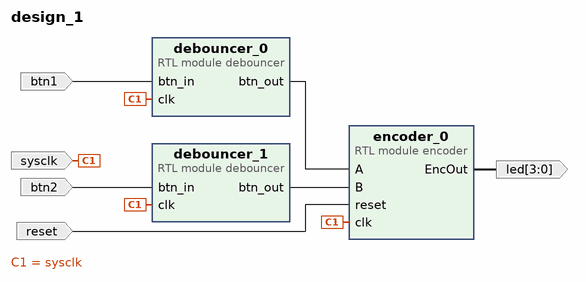
[diagram p0: block diagram of the top level]
# Vivado block design design_1, xc7z020clg400-1, Vivado 2023.2
create_bd_design design_1

create_bd_port -dir I -type clk sysclk
create_bd_port -dir I btn1
create_bd_port -dir I btn2
create_bd_port -dir O -from 3 -to 0 led
create_bd_port -dir I -type rst reset

create_bd_cell -type module -reference encoder encoder_0
create_bd_cell -type module -reference debouncer debouncer_0
create_bd_cell -type module -reference debouncer debouncer_1

# ---- connections ----

connect_bd_net -net btn1_1 [get_bd_ports btn1] [get_bd_pins debouncer_0/btn_in]
connect_bd_net -net btn2_1 [get_bd_ports btn2] [get_bd_pins debouncer_1/btn_in]
connect_bd_net -net clk_0_1 [get_bd_ports sysclk] [get_bd_pins debouncer_0/clk] [get_bd_pins debouncer_1/clk] [get_bd_pins encoder_0/clk]
connect_bd_net [get_bd_pins debouncer_0/btn_out] [get_bd_pins encoder_0/A]
connect_bd_net [get_bd_pins debouncer_1/btn_out] [get_bd_pins encoder_0/B]
connect_bd_net [get_bd_pins encoder_0/EncOut] [get_bd_ports led]
connect_bd_net -net reset_0_1 [get_bd_ports reset] [get_bd_pins encoder_0/reset]

validate_bd_design
save_bd_design
